# EAGLE design module (EAGLE 8.3.1)
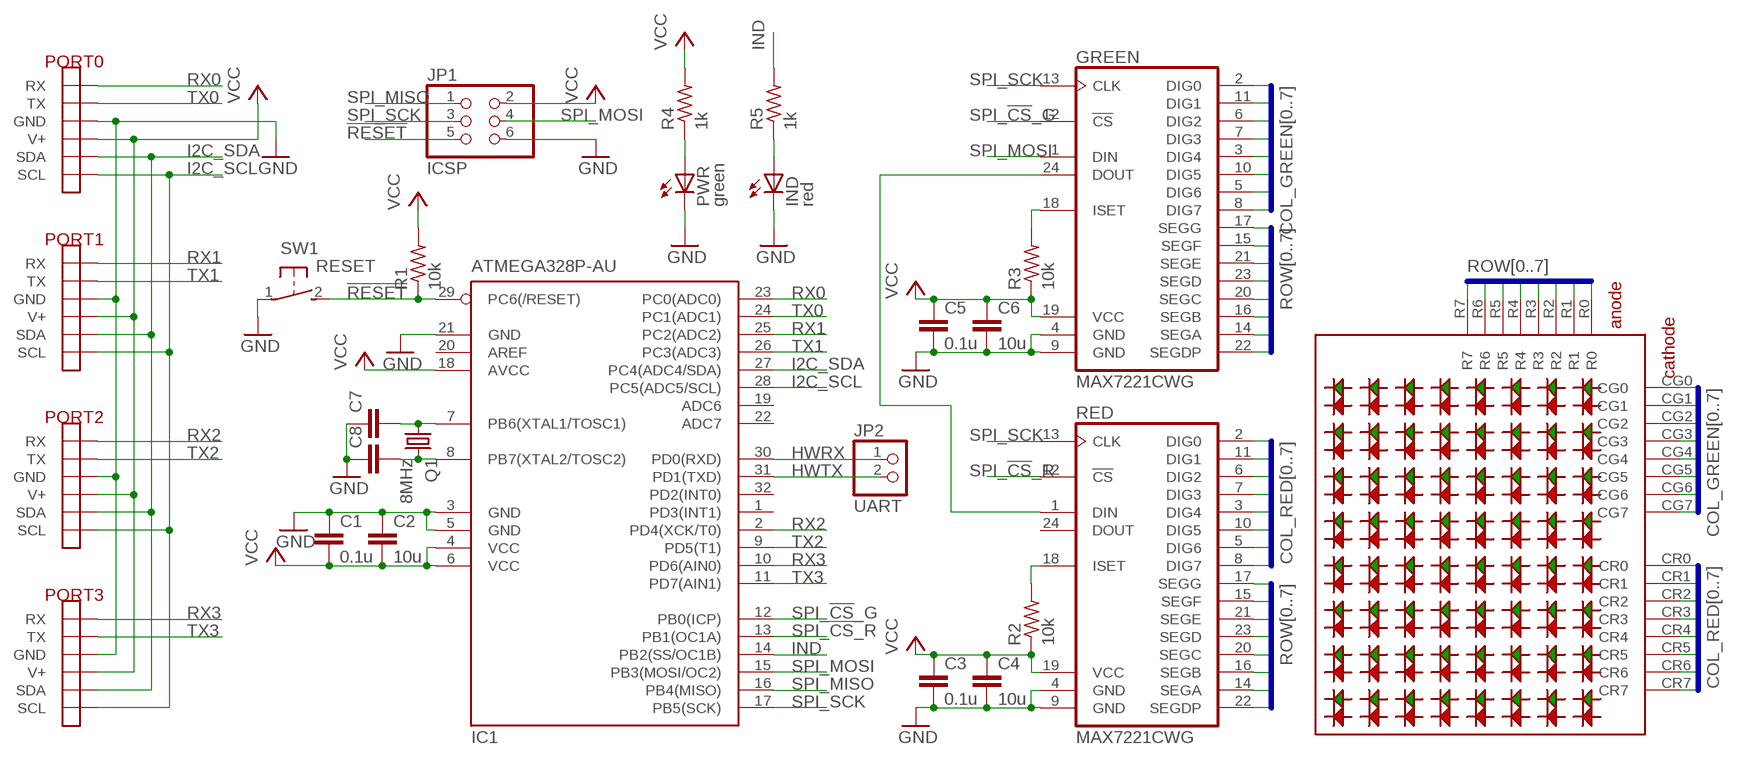
[diagram p0: schematic, sheet 1]

## Parts
C1  0.1u  C-EUC0805  [C0805]
C2  10u  C-EUC1206  [C1206]
C3  0.1u  C-EUC0805  [C0805]
C4  10u  C-EUC1206  [C1206]
C5  0.1u  C-EUC0805  [C0805]
C6  10u  C-EUC1206  [C1206]
C7  C-EUC0805  [C0805]
C8  C-EUC0805  [C0805]
GREEN  MAX7221CWG  [SO24L]
IC1  ATMEGA328P-AU  [TQFP32-08]
IND  red  LEDCHIPLED_0805  [CHIPLED_0805]
JP1  ICSP  PINHD-2X3  [2X03]
JP2  UART  PINHD-1X2  [1X02]
PORT0  PORT  [PORT]
PORT1  PORT  [PORT]
PORT2  PORT  [PORT]
PORT3  PORT  [PORT]
PWR  green  LEDCHIPLED_0805  [CHIPLED_0805]
Q1  8MHz  CRYSTALHC49UP  [HC49UP]
R1  10k  R-US_R0805  [R0805]
R2  10k  R-US_R0805  [R0805]
R3  10k  R-US_R0805  [R0805]
R4  1k  R-US_R0805  [R0805]
R5  1k  R-US_R0805  [R0805]
RED  MAX7221CWG  [SO24L]
SW1  RESET  DTSM-3  [DTSM-3]
U$2  88LED_MATRIX_BICOLOR_ROW_ANODE  [8*8LED_MATRIX_BICOLOR_ROW_ANODE]

## Nets
!RESET!: IC1.29(PC6(/RESET)) JP1.5 R1.1 SW1.2
COL_GREEN0: GREEN.2(DIG0) U$2.CG0
COL_GREEN1: GREEN.11(DIG1) U$2.CG1
COL_GREEN2: GREEN.6(DIG2) U$2.CG2
COL_GREEN3: GREEN.7(DIG3) U$2.CG3
COL_GREEN4: GREEN.3(DIG4) U$2.CG4
COL_GREEN5: GREEN.10(DIG5) U$2.CG5
COL_GREEN6: GREEN.5(DIG6) U$2.CG6
COL_GREEN7: GREEN.8(DIG7) U$2.CG7
COL_RED0: RED.2(DIG0) U$2.CR0
COL_RED1: RED.11(DIG1) U$2.CR1
COL_RED2: RED.6(DIG2) U$2.CR2
COL_RED3: RED.7(DIG3) U$2.CR3
COL_RED4: RED.3(DIG4) U$2.CR4
COL_RED5: RED.10(DIG5) U$2.CR5
COL_RED6: RED.5(DIG6) U$2.CR6
COL_RED7: RED.8(DIG7) U$2.CR7
GND: C1.1 C2.1 C3.2 C4.2 C5.2 C6.2 C7.1 C8.1 GREEN.4(GND) GREEN.9(GND) IC1.3(GND) IC1.5(GND) IC1.21(GND) IND.C JP1.6 PORT0.GND_L(GND) PORT0.GND_L_D(GND) PORT0.GND_R(GND) PORT0.GND_R_D(GND) PORT1.GND_L(GND) PORT1.GND_L_D(GND) PORT1.GND_R(GND) PORT1.GND_R_D(GND) PORT2.GND_L(GND) PORT2.GND_L_D(GND) PORT2.GND_R(GND) PORT2.GND_R_D(GND) PORT3.GND_L(GND) PORT3.GND_L_D(GND) PORT3.GND_R(GND) PORT3.GND_R_D(GND) PWR.C RED.4(GND) RED.9(GND) SW1.1
HWRX: IC1.30(PD0(RXD)) JP2.1
HWTX: IC1.31(PD1(TXD)) JP2.2
I2C_SCL: IC1.28(PC5(ADC5/SCL)) PORT0.SCL_L(SCL) PORT0.SCL_L_D(SCL) PORT0.SCL_R(SCL) PORT0.SCL_R_D(SCL) PORT1.SCL_L(SCL) PORT1.SCL_L_D(SCL) PORT1.SCL_R(SCL) PORT1.SCL_R_D(SCL) PORT2.SCL_L(SCL) PORT2.SCL_L_D(SCL) PORT2.SCL_R(SCL) PORT2.SCL_R_D(SCL) PORT3.SCL_L(SCL) PORT3.SCL_L_D(SCL) PORT3.SCL_R(SCL) PORT3.SCL_R_D(SCL)
I2C_SDA: IC1.27(PC4(ADC4/SDA)) PORT0.SDA_L(SDA) PORT0.SDA_L_D(SDA) PORT0.SDA_R(SDA) PORT0.SDA_R_D(SDA) PORT1.SDA_L(SDA) PORT1.SDA_L_D(SDA) PORT1.SDA_R(SDA) PORT1.SDA_R_D(SDA) PORT2.SDA_L(SDA) PORT2.SDA_L_D(SDA) PORT2.SDA_R(SDA) PORT2.SDA_R_D(SDA) PORT3.SDA_L(SDA) PORT3.SDA_L_D(SDA) PORT3.SDA_R(SDA) PORT3.SDA_R_D(SDA)
IND: IC1.14(PB2(SS/OC1B)) R5.2
N$1: C7.2 IC1.7(PB6(XTAL1/TOSC1)) Q1.1
N$2: C8.2 IC1.8(PB7(XTAL2/TOSC2)) Q1.2
N$3: GREEN.18(ISET) R3.2
N$4: GREEN.24(DOUT) RED.1(DIN)
N$5: PWR.A R4.1
N$6: IND.A R5.1
N$23: R2.2 RED.18(ISET)
ROW0: GREEN.17(SEGG) RED.17(SEGG) U$2.R0
ROW1: GREEN.15(SEGF) RED.15(SEGF) U$2.R1
ROW2: GREEN.21(SEGE) RED.21(SEGE) U$2.R2
ROW3: GREEN.23(SEGD) RED.23(SEGD) U$2.R3
ROW4: GREEN.20(SEGC) RED.20(SEGC) U$2.R4
ROW5: GREEN.16(SEGB) RED.16(SEGB) U$2.R5
ROW6: GREEN.14(SEGA) RED.14(SEGA) U$2.R6
ROW7: GREEN.22(SEGDP) RED.22(SEGDP) U$2.R7
RX0: IC1.23(PC0(ADC0)) PORT0.RX_L(RX) PORT0.RX_L_D(RX)
RX1: IC1.25(PC2(ADC2)) PORT1.RX_L(RX) PORT1.RX_L_D(RX)
RX2: IC1.2(PD4(XCK/T0)) PORT2.RX_L(RX) PORT2.RX_L_D(RX)
RX3: IC1.10(PD6(AIN0)) PORT3.RX_L(RX) PORT3.RX_L_D(RX)
SPI_!CS!_G: GREEN.12(!CS!) IC1.12(PB0(ICP))
SPI_!CS!_R: IC1.13(PB1(OC1A)) RED.12(!CS!)
SPI_MISO: IC1.16(PB4(MISO)) JP1.1
SPI_MOSI: GREEN.1(DIN) IC1.15(PB3(MOSI/OC2)) JP1.4
SPI_SCK: GREEN.13(CLK) IC1.17(PB5(SCK)) JP1.3 RED.13(CLK)
TX0: IC1.24(PC1(ADC1)) PORT0.TX_R(TX) PORT0.TX_R_D(TX)
TX1: IC1.26(PC3(ADC3)) PORT1.TX_R(TX) PORT1.TX_R_D(TX)
TX2: IC1.9(PD5(T1)) PORT2.TX_R(TX) PORT2.TX_R_D(TX)
TX3: IC1.11(PD7(AIN1)) PORT3.TX_R(TX) PORT3.TX_R_D(TX)
VCC: C1.2 C2.2 C3.1 C4.1 C5.1 C6.1 GREEN.19(VCC) IC1.4(VCC) IC1.6(VCC) IC1.18(AVCC) JP1.2 PORT0.V+_L(V+) PORT0.V+_L_D(V+) PORT0.V+_R(V+) PORT0.V+_R_D(V+) PORT1.V+_L(V+) PORT1.V+_L_D(V+) PORT1.V+_R(V+) PORT1.V+_R_D(V+) PORT2.V+_L(V+) PORT2.V+_L_D(V+) PORT2.V+_R(V+) PORT2.V+_R_D(V+) PORT3.V+_L(V+) PORT3.V+_L_D(V+) PORT3.V+_R(V+) PORT3.V+_R_D(V+) R1.2 R2.1 R3.1 R4.2 RED.19(VCC)
Unconnected: IC1.1(PD3(INT1)) IC1.19(ADC6) IC1.20(AREF) IC1.22(ADC7) IC1.32(PD2(INT0)) RED.24(DOUT)

## Buses
ROW[0..7]
COL_RED[0..7]
COL_GREEN[0..7]

## Library data of the parts
C1-C8 = rcl:C-EU: CAPACITOR, European symbol
GREEN RED = MoDisp:MAX7221: LED DISPLAY DRIVER compatible with MAX7219, MAX7221, AS1106, AS1107; MF: MAXIM; MPN: MAX7221CWG
IC1 = MoDisp:ATMEGA328P-AU: MICROCONTROLLER 8 Kbytes FLASH, 1 kbytes SRAM, 512 bytes EEPROM, USART, 6-channel 10 bit ADC, 2-channel 8 bit ADC Pin compatible with Atmega48, ATMega88, ATMega168 Source: avr.lbr; MF: ATMEL; MPN: ATMEGA328P-AU
IND PWR = led:LED: LED OSRAM: - CHIPLED LG R971, LG N971, LY N971, LG Q971, LY Q971, LO R971, LY R971 LH N974, LH R974 LS Q976, LO Q976, LY Q976 LO Q996 - Hyper CHIPLED LW Q18S LB Q993, LB Q99A, LB R99A - SideLED LS A670, LO A670, LY A670, LG A670, LP A670 LB A673, LV A673, LT A673, LW A673 LH A674 LY A675 LS A676, LA A676, LO A676, LY A676, LW A676 LS A679, LY A679, LG A679 - Hyper Micro SIDELED® LS Y876, LA Y876, LO Y876, LY Y876 LT Y87S - SmartLED LW L88C, LW L88S LB L89C, LB L89S, LG L890 LS L89K, LO L89K, LY L89K LS L896, LA L896, LO L896, LY L896 - TOPLED LS T670, LO T670, LY T670, LG T670, LP T670 LSG T670, LSP T670, LSY T670, LOP T670, LYG T670 LG T671, LOG T671, LSG T671 LB T673, LV T673, LT T673, LW T673 LH T674 LS T676, LA T676, LO T676, LY T676, LB T676, LH T676, LSB T676, LW T676 LB T67C, LV T67C, LT T67C, LS T67K, LO T67K, LY T67K, LW E67C LS E67B, LA E67B, LO E67B, LY E67B, LB E67C, LV E67C, LT E67C LW T67C LS T679, LY T679, LG T679 LS T770, LO T770, LY T770, LG T770, LP T770 LB T773, LV T773, LT T773, LW T773 LH T774 LS E675, LA E675, LY E675, LS T675 LS T776, LA T776, LO T776, LY T776, LB T776 LHGB T686 LT T68C, LB T68C - Hyper Mini TOPLED® LB M676 - Mini TOPLED Santana® LG M470 LS M47K, LO M47K, LY M47K Source: http://www.osram.convergy.de LUXEON: - LUMILED® LXK2-PW12-R00, LXK2-PW12-S00, LXK2-PW14-U00, LXK2-PW14-V00 LXK2-PM12-R00, LXK2-PM12-S00, LXK2-PM14-U00 LXK2-PE12-Q00, LXK2-PE12-R00, LXK2-PE12-S00, LXK2-PE14-T00, LXK2-PE14-U00 LXK2-PB12-K00, LXK2-PB12-L00, LXK2-PB12-M00, LXK2-PB14-N00, LXK2-PB14-P00, LXK2-PB14-Q00 LXK2-PR12-L00, LXK2-PR12-M00, LXK2-PR14-Q00, LXK2-PR14-R00 LXK2-PD12-Q00, LXK2-PD12-R00, LXK2-PD12-S00 LXK2-PH12-R00, LXK2-PH12-S00 LXK2-PL12-P00, LXK2-PL12-Q00, LXK2-PL12-R00 Source: www.luxeon.com KINGBRIGHT: KA-3528ASYC Source: www.kingbright.com
JP1 = MoDisp:PINHD-2X3: PIN HEADER
JP2 = MoDisp:PINHD-1X2: PIN HEADER
PORT0 PORT1-PORT3 = MoDisp:PORT
Q1 = crystal:CRYSTAL: CRYSTAL; OC_FARNELL: unknown; OC_NEWARK: unknown
R1-R5 = rcl:R-US_: RESISTOR, American symbol
SW1 = MoDisp:DTSM-3
U$2 = MoDisp:8*8LED_MATRIX_BICOLOR_ROW_ANODE

## Board
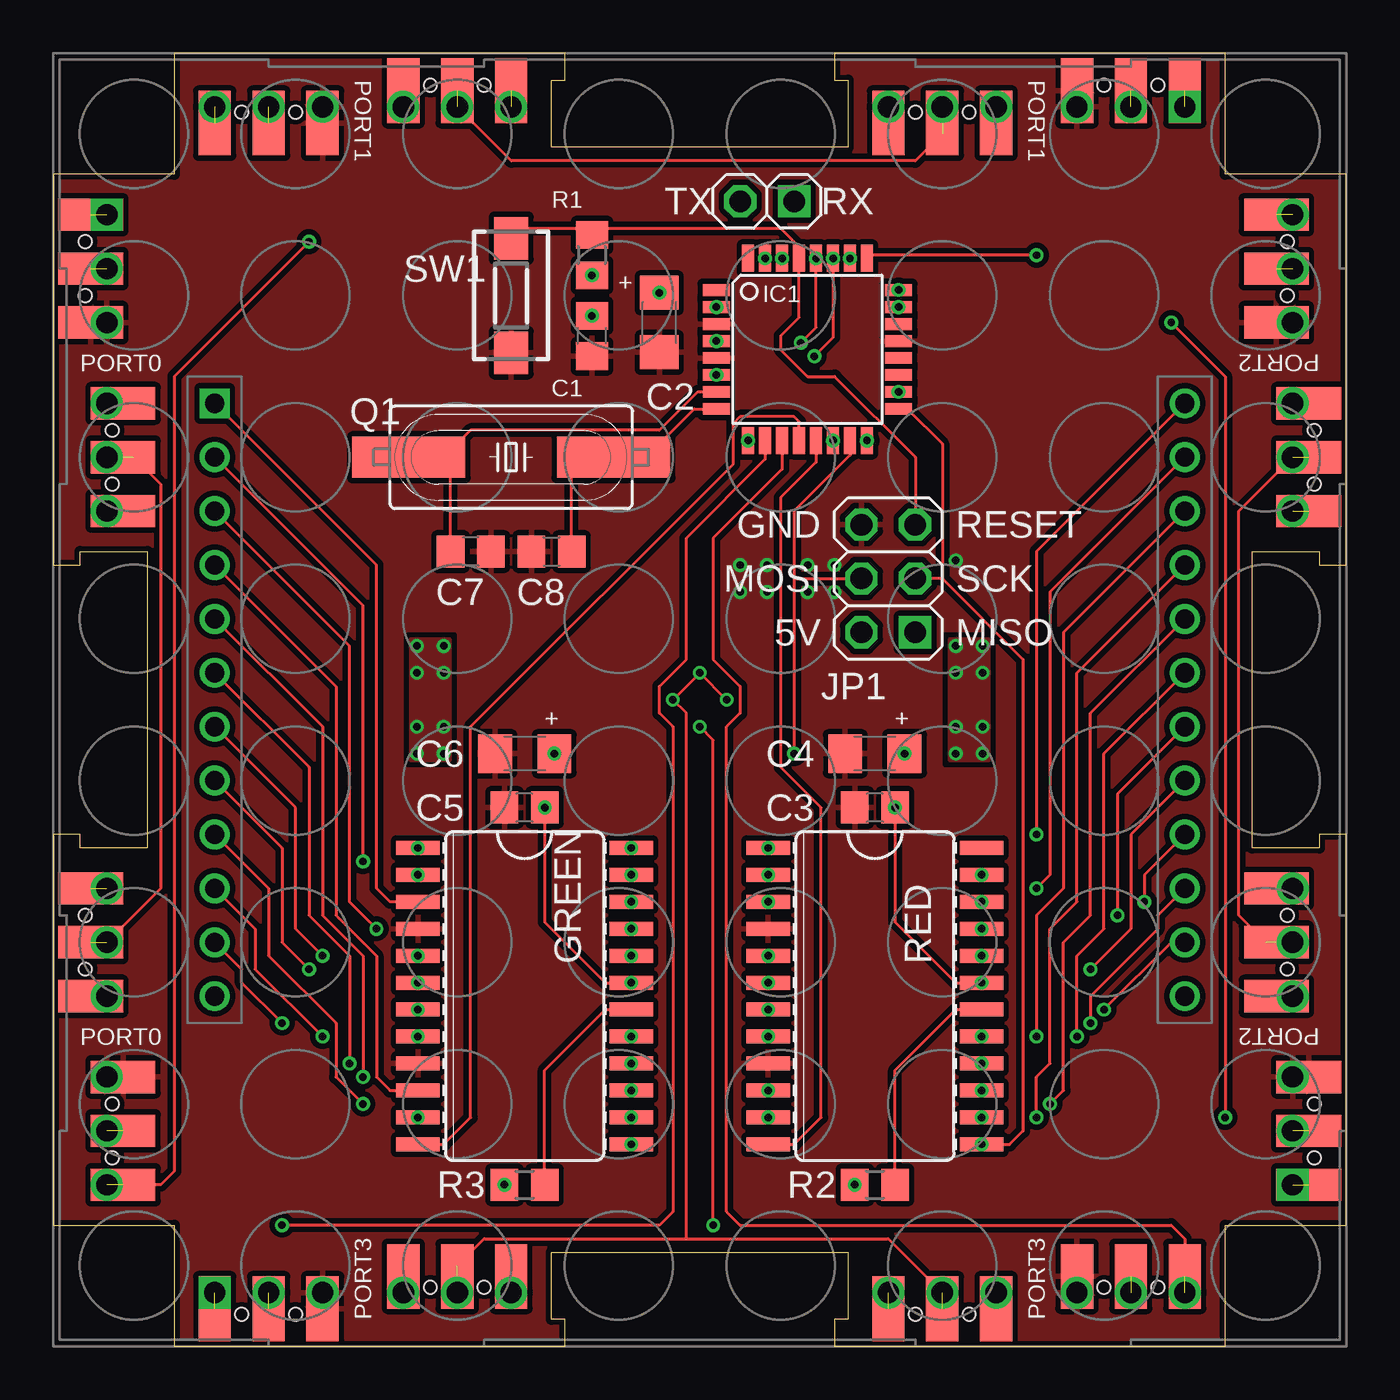
[diagram p1: board, top side]
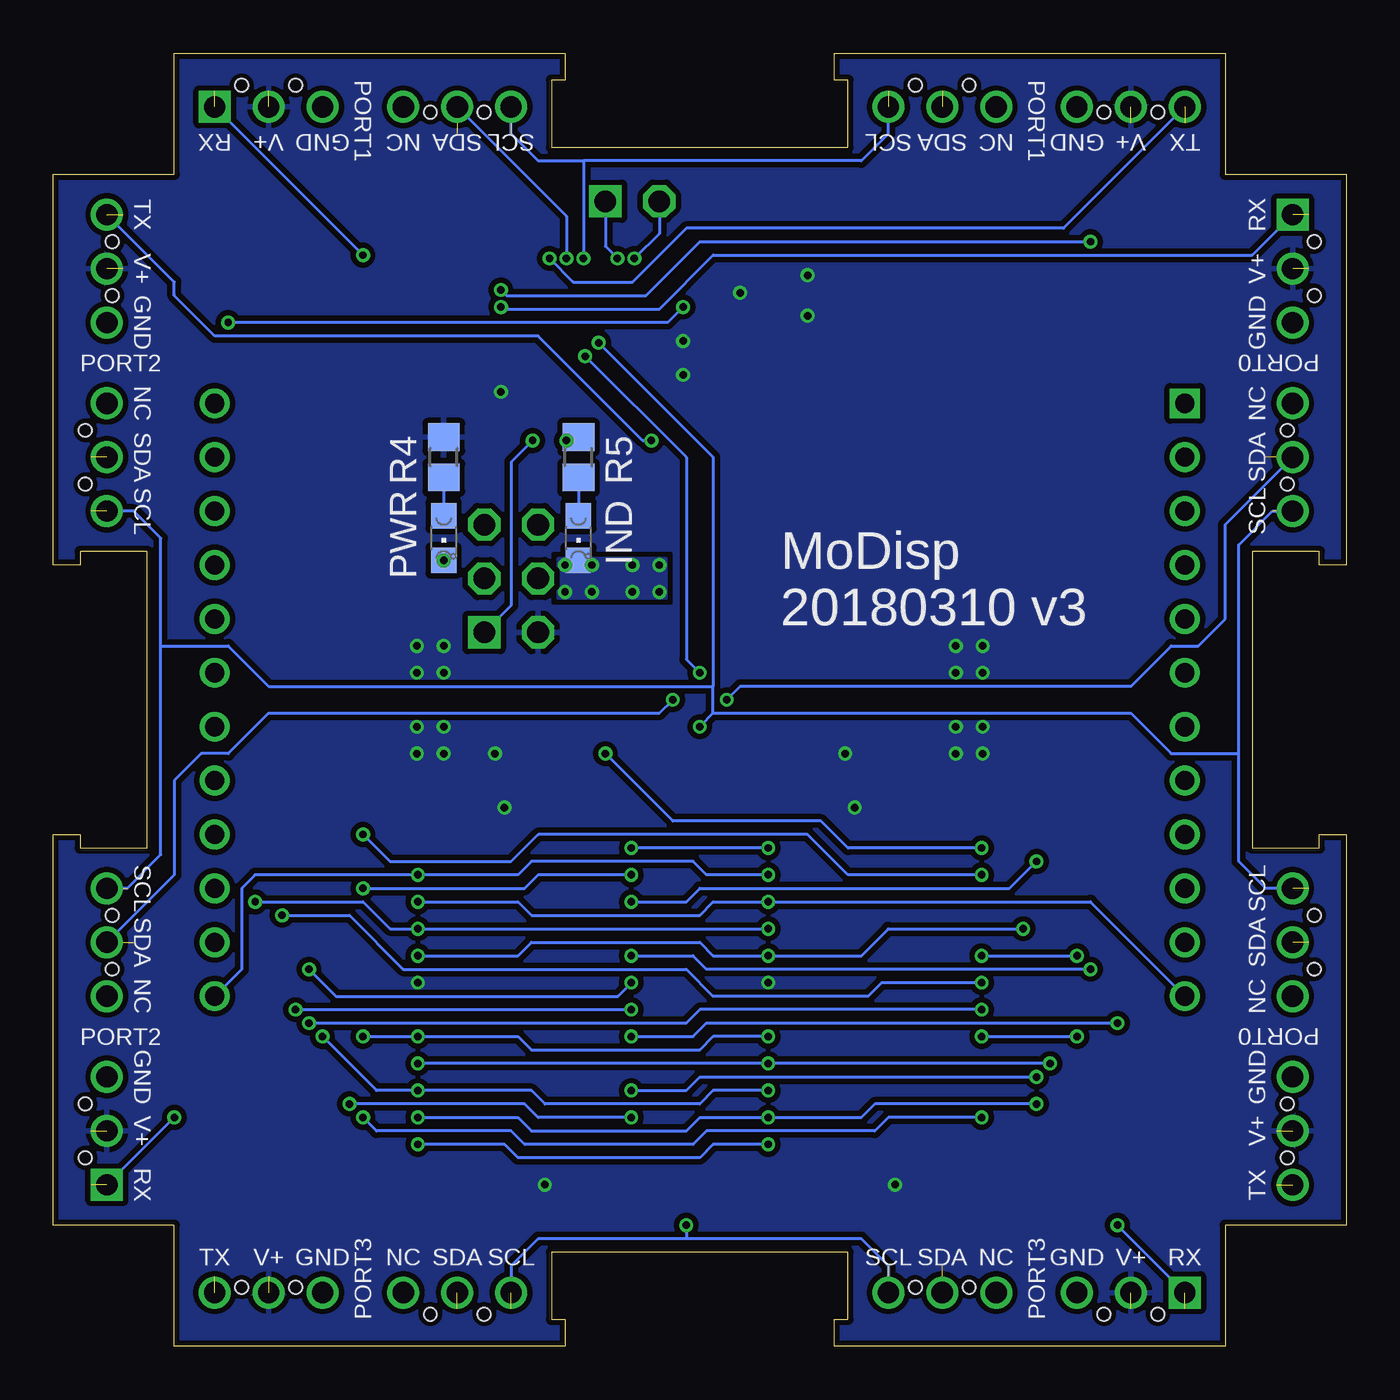
[diagram p2: board, bottom side, seen from below]

Size 60.96 x 60.96 mm. Coordinates in mm from the lower left corner, seen from the top.
Outline: 0,5.71 5.71,5.71 5.71,0 24.13,0 24.13,1.27 23.5,1.27 23.5,4.45 37.47,4.45 37.47,1.27 36.83,1.27 36.83,0 55.24,0 55.24,5.71 60.96,5.71 60.96,24.13 59.69,24.13 59.69,23.5 56.52,23.5 56.52,37.47 59.69,37.47 59.69,36.83 60.96,36.83 60.96,55.24 55.24,55.24 55.24,60.96 36.83,60.96 36.83,59.69 37.47,59.69 37.47,56.52 23.5,56.52 23.5,59.69 24.13,59.69 24.13,60.96 5.71,60.96 5.71,55.24 0,55.24 0,36.83 1.27,36.83 1.27,37.47 4.45,37.47 4.45,23.5 1.27,23.5 1.27,24.13 0,24.13 0,5.71
Copper layers (1*16): Top 0.035mm / dielectric 1.5mm / Bottom 0.035mm
Design rules "SeeedStudio_2layer_DRU_no_angle_20140221": minimum track width 6mil, minimum drill 12mil, track to track 6mil, track to pad 6mil, pad to pad 6mil, via to via 6mil, smd to smd 0mil, copper to edge 10mil, drill to drill 10mil, minimum pad ring 10mil, minimum via ring 6mil, stop-mask expansion 2mil, vias tented up to drill 100mil, thermal gap 10mil

### Footprints (pad centres in the part's own frame; a part is rotated, then mirrored left to right if it is on the bottom)
C0805 = smd 1.3 x 1.5: 1 -0.95,0; 2 0.95,0
C1206 = smd 1.6 x 1.8: 1 -1.4,0; 2 1.4,0
SO24L = smd 0.66 x 2.032: 1 -6.985,-5.029; 2 -5.715,-5.029; 3 -4.445,-5.029; 4 -3.175,-5.029; 5 -1.905,-5.029; 6 -0.635,-5.029; 7 0.635,-5.029; 8 1.905,-5.029; 9 3.175,-5.029; 10 4.445,-5.029; 11 5.715,-5.029; 12 6.985,-5.029; 13 6.985,5.029; 14 5.715,5.029; 15 4.445,5.029; 16 3.175,5.029; 17 1.905,5.029; 18 0.635,5.029; 19 -0.635,5.029; 20 -1.905,5.029; 21 -3.175,5.029; 22 -4.445,5.029; 23 -5.715,5.029; 24 -6.985,5.029
TQFP32-08 = smd 1.27 x 0.559: 1 -4.293,2.8; 2 -4.293,2; 3 -4.293,1.2; 4 -4.293,0.4; 5 -4.293,-0.4; 6 -4.293,-1.2; 7 -4.293,-2; 8 -4.293,-2.8; 17 4.293,-2.8; 18 4.293,-2; 19 4.293,-1.2; 20 4.293,-0.4; 21 4.293,0.4; 22 4.293,1.2; 23 4.293,2; 24 4.293,2.8 | smd 0.559 x 1.27: 9 -2.8,-4.293; 10 -2,-4.293; 11 -1.2,-4.293; 12 -0.4,-4.293; 13 0.4,-4.293; 14 1.2,-4.293; 15 2,-4.293; 16 2.8,-4.293; 25 2.8,4.293; 26 2,4.293; 27 1.2,4.293; 28 0.4,4.293; 29 -0.4,4.293; 30 -1.2,4.293; 31 -2,4.293; 32 -2.8,4.293
CHIPLED_0805 = smd 1.2 x 1.2: A 0,-1.05; C 0,1.05
2X03 = drill 1.016 square: 1 -2.54,-1.27 | drill 1.016 octagon: 2 -2.54,1.27; 3 0,-1.27; 4 0,1.27; 5 2.54,-1.27; 6 2.54,1.27
1X02 = drill 1.016 square: 1 -1.27,0 | drill 1.016 octagon: 2 1.27,0
PORT = smd 3.048 x 1.524: GND_L 1.778,17.78; GND_R 3.302,-17.78; NC_L 3.302,13.97; NC_R 1.778,-13.97; RX_L 1.778,22.86; SCL_L 3.302,8.89; SCL_R 1.778,-8.89; SDA_L 3.302,11.43; SDA_R 1.778,-11.43; TX_R 3.302,-22.86; V+_L 1.778,20.32; V+_R 3.302,-20.32 | drill 1: GND_L_D 2.54,17.78; GND_R_D 2.54,-17.78; NC_L_D 2.54,13.97; NC_R_D 2.54,-13.97; SCL_L_D 2.54,8.89; SCL_R_D 2.54,-8.89; SDA_L_D 2.54,11.43; SDA_R_D 2.54,-11.43; TX_R_D 2.54,-22.86; V+_L_D 2.54,20.32; V+_R_D 2.54,-20.32 | drill 1 square: RX_L_D 2.54,22.86 | hole 0.6: 2.794,-21.59; 2.794,-19.05; 2.794,10.16; 2.794,12.7; 1.524,-12.7; 1.524,-10.16; 1.524,19.05; 1.524,21.59
HC49UP = smd 5.334 x 1.93: 1 -4.826,0; 2 4.826,0
R0805 = smd 1.3 x 1.5: 1 -0.95,0; 2 0.95,0
DTSM-3 = smd 2 x 1.6: 1 -2.7,0; 2 2.7,0
8*8LED_MATRIX_BICOLOR_ROW_ANODE = drill 0.9: CG0 -13.97,22.86; CG1 -6.35,22.86; CG2 1.27,22.86; CG3 8.89,22.86; CG5 -6.35,-22.86; CG6 1.27,-22.86; CG7 8.89,-22.86; CR0 -11.43,22.86; CR1 -3.81,22.86; CR2 3.81,22.86; CR3 11.43,22.86; CR4 -11.43,-22.86; CR5 -3.81,-22.86; CR6 3.81,-22.86; CR7 11.43,-22.86; R0 -8.89,22.86; R1 -1.27,22.86; R2 6.35,22.86; R3 13.97,22.86; R4 -8.89,-22.86; R5 -1.27,-22.86; R6 6.35,-22.86; R7 13.97,-22.86 | drill 0.9 square: CG4 -13.97,-22.86

### Placement (x,y rotation side)
C1  25.4,47.62 90 top
C2  28.57,48.26 90 top
C3  38.73,25.4 180 top
C4  38.73,27.94 180 top
C5  22.23,25.4 180 top
C6  22.23,27.94 180 top
C7  19.68,37.47 180 top
C8  23.5,37.47 0 top
GREEN  22.23,16.51 270 top
IC1  35.56,46.99 0 top
IND  36.2,38.1 180 bottom
JP1  39.37,36.2 90 top
JP2  33.66,53.98 180 top
PORT0  0,30.48 0 top
PORT1  30.48,60.96 270 top
PORT2  60.96,30.48 180 top
PORT3  30.48,0 90 top
PWR  42.55,38.1 180 bottom
Q1  21.59,41.91 0 top
R1  25.4,51.44 270 top
R2  38.73,7.62 0 top
R3  22.23,7.62 0 top
R4  42.55,41.91 90 bottom
R5  36.2,41.91 90 bottom
RED  38.73,16.51 270 top
SW1  21.59,49.53 90 top
U$2  30.48,30.48 270 top

### Tracks (layer width: path | path; a pad name or v marks a point on that pad's centre or on a via)
!RESET!
  Top 0.152: JP1.5 40.64,41.91 36.83,45.72 35.56,45.72 34.29,46.99 34.29,47.62 35.16,48.49 IC1.29 35.16,51.84 34.29,52.7 25.4,52.7 | SW1.2 21.59,52.7 25.4,52.7 | R1.1 25.4,52.7
COL_GREEN0  (via drill 0.35)
  Top 0.152: U$2.CG0 46.35,37.47 v46.35,24.13
  Bottom 0.152: GREEN.2 23.5,22.23 25.4,24.13 38.1,24.13 39.37,22.86 45.09,22.86 v46.35,24.13
  other vias: 17.2,22.23
COL_GREEN1  (via drill 0.35)
  Top 0.152: U$2.CG1 48.26,31.75 48.26,20.95 46.99,19.68 46.99,13.34 46.35,12.7 v46.35,10.79
  Bottom 0.152: v17.2,10.79 21.59,10.79 22.23,10.16 30.16,10.16 30.8,9.53 38.73,9.53 39.37,10.16 45.72,10.16 v46.35,10.79
COL_GREEN2  (via drill 0.35)
  Top 0.152: U$2.CG2 50.16,26.04 v50.16,20.32
  Bottom 0.152: v17.2,17.14 21.91,17.14 22.54,16.51 29.84,16.51 31.11,17.78 44.45,17.78 46.99,20.32 v50.16,20.32
COL_GREEN3  (via drill 0.35)
  Top 0.152: U$2.CG3 52.07,20.32 52.07,19.68 48.9,16.51 v48.9,15.24
  Bottom 0.152: GREEN.7 30.48,15.88 31.11,15.24 v48.9,15.24
  other vias: 17.2,15.88
COL_GREEN4
  Top 0.152: U$2.CG4 15.24,36.83 15.24,21.59 15.88,20.95 GREEN.3
COL_GREEN5
  Top 0.152: U$2.CG5 13.34,31.11 13.34,20.32 15.24,18.41 15.24,12.7 15.88,12.06 GREEN.10
COL_GREEN6  (via drill 0.35)
  Top 0.152: U$2.CG6 11.43,25.4 11.43,19.68 v12.7,18.41
  Bottom 0.152: v17.2,18.41 v12.7,18.41
COL_GREEN7  (via drill 0.35)
  Top 0.152: U$2.CG7 9.53,19.68 9.53,17.78 v12.7,14.61
  Bottom 0.152: GREEN.8 v12.7,14.61
  other vias: 17.2,14.61
COL_RED0  (via drill 0.35)
  Top 0.152: U$2.CR0 46.99,35.56 46.99,22.23 v46.35,21.59
  Bottom 0.152: RED.2 38.1,22.23 38.73,21.59 v46.35,21.59
  other vias: 33.71,22.23
COL_RED1  (via drill 0.35)
  Top 0.152: U$2.CR1 48.9,29.84 48.9,20.32 47.62,19.05 47.62,12.06 v46.99,11.43
  Bottom 0.152: v33.71,10.79 38.1,10.79 38.73,11.43 v46.99,11.43
COL_RED2  (via drill 0.35)
  Top 0.152: v48.9,17.78 50.8,19.68 50.8,24.13 U$2.CR2
  Bottom 0.152: v33.71,17.14 34.34,16.51 47.62,16.51 v48.9,17.78
COL_RED3  (via drill 0.35)
  Top 0.152: U$2.CR3 52.7,19.05 v49.53,15.88
  Bottom 0.152: v49.53,15.88 RED.7
  other vias: 33.71,15.88
COL_RED4  (via drill 0.35)
  Top 0.152: U$2.CR4 14.61,34.92 v14.61,22.86
  Bottom 0.152: v33.71,20.95 31.11,20.95 30.48,21.59 15.88,21.59 v14.61,22.86
COL_RED5  (via drill 0.35)
  Top 0.152: U$2.CR5 12.7,29.21 12.7,20.32 14.61,18.41 v14.61,12.7
  Bottom 0.152: v33.71,12.06 31.11,12.06 30.48,12.7 v14.61,12.7
COL_RED6  (via drill 0.35)
  Top 0.152: U$2.CR6 10.79,23.5 10.79,19.05 v12.06,17.78
  Bottom 0.152: v33.71,18.41 30.8,18.41 30.16,17.78 v12.06,17.78
COL_RED7  (via drill 0.35)
  Top 0.152: v10.79,15.24 8.89,17.14 8.89,17.78 U$2.CR7
  Bottom 0.152: RED.8 30.8,14.61 30.16,15.24 v10.79,15.24
  other vias: 33.71,14.61
GND  (via drill 0.35)
  Bottom 0.152: v36.83,36.83 36.41,36.83 IND.C
  other vias: 32.38,35.56 36.83,35.56 33.66,35.56 35.56,35.56 32.38,36.83 33.66,36.83 35.56,36.83 42.55,37.05
  pour Top (isolate 0.254, rank 2): 0,60.96 0,0 60.96,0 60.96,60.96
  pour Bottom (isolate 0.254, no thermals): 32.07,37.15 32.07,35.24 37.15,35.24 37.15,37.15
HWRX  (via drill 0.35)
  Bottom 0.152: JP2.1 34.92,51.85 IC1.30
  other vias: 34.36,51.28
HWTX  (via drill 0.35)
  Bottom 0.152: JP2.2 32.38,52.46 IC1.31
  other vias: 33.56,51.28
I2C_SCL  (via drill 0.35)  (8 unrouted)
  Top 0.152: IC1.28 35.96,48.02 v35.24,47.31 | v31.11,5.71 31.11,28.57 v30.48,29.21
  Bottom 0.152: v35.24,47.31 29.84,41.91 29.84,31.11 | PORT0.SCL_L_D 3.49,39.37 5.08,37.78 5.08,27.94 | 5.08,27.94 5.08,22.86 3.81,21.59 PORT0.SCL_R_D | 31.11,5.08 22.86,5.08 21.59,3.81 PORT3.SCL_L_D | PORT3.SCL_R_D 39.37,3.81 38.1,5.08 31.11,5.08 | v31.11,5.71 31.11,5.08 | PORT2.SCL_L_D 57.47,21.59 55.88,23.18 55.88,33.02 | 29.84,31.11 50.8,31.11 52.7,33.02 55.88,33.02 | PORT1.SCL_L_D 39.37,57.15 38.1,55.88 35.96,55.88 | 29.84,29.84 10.16,29.84 8.26,27.94 5.08,27.94 | PORT1.SCL_R_D 21.59,57.15 22.86,55.88 35.96,55.88 | PORT2.SCL_R_D 57.15,39.37 55.88,38.1 55.88,33.02 | 29.84,29.84 29.84,31.11 | 29.84,29.84 v30.48,29.21 | 35.96,55.88 IC1.28
  other vias: 35.96,51.28
I2C_SDA  (via drill 0.35)  (8 unrouted)
  Top 0.152: IC1.27 36.76,47.55 v35.88,46.67 | PORT0.SDA_R_D 5.08,21.59 5.08,40.64 3.81,41.91 PORT0.SDA_L_D | PORT3.SDA_L_D 19.05,3.81 20.32,5.08 29.84,5.08 | 29.84,5.08 39.37,5.08 PORT3.SDA_R_D | PORT2.SDA_R_D 55.88,39.37 55.88,20.32 57.15,19.05 PORT2.SDA_L_D | PORT1.SDA_R_D 21.59,55.88 40.64,55.88 41.91,57.15 PORT1.SDA_L_D | 29.84,5.08 29.84,29.84 v29.21,30.48 v30.48,31.75 v31.75,30.48
  Bottom 0.152: v30.48,31.75 31.11,32.38 31.11,41.91 v35.88,46.67 | v29.21,30.48 28.57,31.11 10.16,31.11 8.26,33.02 6.99,33.02 5.71,34.29 5.71,38.73 PORT0.SDA_L_D | v31.75,30.48 32.38,29.84 50.8,29.84 52.7,27.94 53.98,27.94 55.24,26.67 55.24,22.23 PORT2.SDA_L_D | IC1.27 36.76,53.27 PORT1.SDA_L_D
  other vias: 36.76,51.28
IND  (via drill 0.35)
  Bottom 0.152: R5.2 36.6,42.86 IC1.14
  other vias: 36.76,42.7
N$1
  Top 0.152: IC1.7 30.39,44.99 28.57,43.18 19.68,43.18 18.41,41.91 Q1.1 18.73,41.91 C7.2
N$2
  Top 0.152: 30.86,44.19 IC1.8 30.22,44.19 27.94,41.91 Q1.2 24.45,41.91 C8.2
N$3
  Top 0.152: GREEN.18 26.04,15.88 23.18,13.02 R3.2
N$4  (via drill 0.35)
  Bottom 0.152: GREEN.24 RED.1
  other vias: 27.25,23.5 33.71,23.5
N$5
  Bottom 0.152: R4.1 PWR.A
N$6
  Bottom 0.152: R5.1 IND.A
N$23
  Top 0.152: R2.2 39.69,13.02 42.55,15.88 RED.18
ROW0  (via drill 0.35)
  Top 0.152: U$2.R0 47.62,33.66 47.62,21.59 46.35,20.32 v46.35,14.61
  Bottom 0.152: GREEN.17 29.84,14.61 30.48,13.97 38.42,13.97 39.05,14.61 RED.17 v46.35,14.61
  other vias: 27.25,14.61 43.76,14.61
ROW1  (via drill 0.35)
  Top 0.152: U$2.R1 49.53,27.94 49.53,19.68 48.26,18.41 v48.26,14.61
  Bottom 0.152: v27.25,12.06 29.84,12.06 30.48,11.43 37.78,11.43 38.42,12.06 v43.76,12.06 45.72,12.06 v48.26,14.61
ROW2  (via drill 0.35)
  Top 0.152: U$2.R2 51.44,22.23 v51.44,20.95
  Bottom 0.152: v27.25,19.68 v43.76,19.68 45.09,19.68 46.35,20.95 v51.44,20.95
ROW3  (via drill 0.35)
  Bottom 0.152: GREEN.23 30.16,22.23 30.8,22.86 38.42,22.86 39.05,22.23 RED.23 51.44,22.23 52.07,21.59 52.07,17.78 U$2.R3
  other vias: 27.25,22.23 43.76,22.23
ROW4  (via drill 0.35)
  Top 0.152: U$2.R4 13.97,33.02 13.97,20.95 v15.24,19.68
  Bottom 0.152: v43.76,18.41 39.05,18.41 38.42,19.05 30.48,19.05 29.84,18.41 v27.25,18.41 22.86,18.41 21.59,19.68 v15.24,19.68
ROW5  (via drill 0.35)
  Top 0.152: U$2.R5 12.06,27.3 12.06,20.32 13.97,18.41 v13.97,13.34
  Bottom 0.152: RED.16 GREEN.16 v13.97,13.34
  other vias: 27.25,13.34 43.76,13.34
ROW6  (via drill 0.35)
  Top 0.152: U$2.R6 10.16,21.59 10.16,18.41 13.34,15.24 13.34,12.7 v14.61,11.43
  Bottom 0.152: v43.76,10.79 39.05,10.79 38.42,10.16 31.11,10.16 30.48,10.79 v27.25,10.79 22.86,10.79 22.23,11.43 v14.61,11.43
ROW7  (via drill 0.35)
  Bottom 0.152: v43.76,20.95 39.05,20.95 38.42,20.32 30.48,20.32 29.84,20.95 v27.25,20.95 12.06,20.95 U$2.R7
RX0  (via drill 0.35)  (1 unrouted)
  Bottom 0.152: PORT0.RX_L_D 4.45,51.44 29.84,51.44 32.38,48.9 39.76,48.9 IC1.23
  other vias: 39.85,48.99
RX1  (via drill 0.35)  (1 unrouted)
  Top 0.152: IC1.25 38.36,51.44 v46.35,51.44
  Bottom 0.152: PORT1.RX_L_D v46.35,51.44
RX2  (via drill 0.35)  (1 unrouted)
  Top 0.152: v52.7,48.26 55.24,45.72 v55.24,10.79
  Bottom 0.152: IC1.2 32,48.26 v52.7,48.26 | v55.24,10.79 PORT2.RX_L_D
  other vias: 31.27,48.99
RX3  (via drill 0.35)  (1 unrouted)
  Top 0.152: IC1.10 33.56,41.81 29.84,38.1 29.84,32.38 28.57,31.11 28.57,29.84 29.21,29.21 29.21,6.35 28.57,5.71 v10.79,5.71
  Bottom 0.152: v10.79,5.71 PORT3.RX_L_D
SPI_!CS!_G
  Top 0.152: GREEN.12 18.41,9.53 19.68,10.79 19.68,29.21 32.07,41.59 32.07,43.5 32.38,43.81 34.92,43.81 | 34.92,43.81 | IC1.12 35.16,43.58 34.92,43.81
SPI_!CS!_R
  Top 0.152: RED.12 34.92,9.53 36.2,10.79 36.2,25.4 34.29,27.3 34.29,40.01 35.96,41.67 IC1.13
SPI_MISO  (via drill 0.35)
  Bottom 0.152: JP1.1 39.37,34.92 39.37,41.69 IC1.16
  other vias: 38.36,42.7
SPI_MOSI  (via drill 0.35)
  Top 0.152: IC1.15 37.56,42.01 34.92,39.37 34.92,36.2 | 34.92,36.2 v34.92,27.94 | 34.92,36.2 JP1.4
  Bottom 0.152: GREEN.1 23.5,23.5 24.77,24.77 31.75,24.77 v34.92,27.94
  other vias: 17.2,23.5
SPI_SCK  (via drill 0.35)
  Top 0.152: RED.13 45.09,9.53 45.72,10.16 45.72,32.38 41.91,36.2 | 41.91,36.2 JP1.3 | IC1.17 40.27,44.19 41.91,42.55 41.91,36.2
  Bottom 0.152: GREEN.13 29.84,9.53 30.48,8.89 39.05,8.89 39.69,9.53 RED.13
  other vias: 27.25,9.53 43.76,9.53
TX0  (via drill 0.35)  (1 unrouted)
  Top 0.152: IC1.24 v39.85,49.8 | PORT0.TX_R_D 5.08,7.62 5.71,8.26 5.71,45.72 v12.06,52.07
  Bottom 0.152: v12.06,52.07 30.48,52.07 33.02,49.53 39.59,49.53 v39.85,49.8
TX1  (via drill 0.35)  (1 unrouted)
  Bottom 0.152: PORT1.TX_R_D 13.34,52.7 31.11,52.7 33.66,50.16 36.44,50.16 IC1.26
  other vias: 37.56,51.28
TX2  (via drill 0.35)  (1 unrouted)
  Bottom 0.152: PORT2.TX_R_D 55.24,50.16 55.24,49.53 53.34,47.62 38.1,47.62 33.17,42.7 IC1.9
  other vias: 32.76,42.7
TX3  (1 unrouted)
  Top 0.152: IC1.11 34.36,41.34 31.11,38.1 31.11,32.38 32.38,31.11 32.38,29.84 31.75,29.21 31.75,6.35 32.38,5.71 52.7,5.71 53.34,5.08 PORT3.TX_R_D
VCC  (via drill 0.35)  (8 unrouted)
  Top 0.152: v43.76,17.14 42.55,17.14 39.69,20 C3.1 | v27.25,17.14 26.04,17.14 23.18,20 C5.1
  other vias: 31.27,47.39 21.27,7.62 23.62,27.94 23.18,25.4 40.13,27.94 39.69,25.4 37.78,7.62 31.27,45.79 25.4,50.48 25.4,48.58 28.57,49.66 39.85,44.99 18.41,31.75 18.41,29.21 18.41,27.94 18.41,33.02 42.55,31.75 42.55,29.21 42.55,33.02 42.55,27.94 43.81,31.75 43.81,29.21 43.81,33.02 43.81,27.94 17.14,31.75 17.14,29.21 17.14,33.02 17.14,27.94
  pour Bottom (isolate 0.254, rank 2): 0,60.96 0,0 60.96,0 60.96,60.96
  pour Bottom (isolate 0.254): 7.62,25.4 7.62,7.62 53.34,7.62 53.34,25.4
  pour Top (isolate 0.254): 42.23,33.34 42.23,27.62 44.13,27.62 44.13,33.34
  pour Top (isolate 0.254): 16.83,33.34 16.83,27.62 18.73,27.62 18.73,33.34

### Text on the board
tPlace: TX | RX | + | GND | RESET | MOSI | SCK | 5V | MISO | + | +
bPlace: MoDisp / 20180310 v3